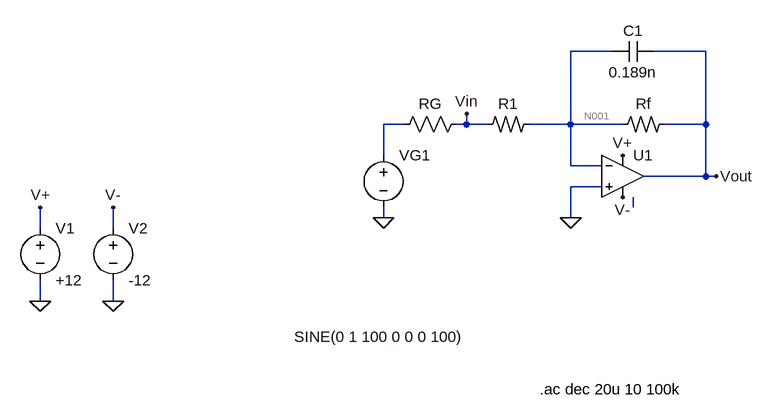
[diagram p0: schematic bode_preamp.asc]
bode_preamp.asc, the LTspice schematic file:
Version 4
SHEET 1 880 680
WIRE -368 -224 -432 -224
WIRE -224 -224 -304 -224
WIRE -688 -112 -720 -112
WIRE -592 -112 -592 -128
WIRE -592 -112 -608 -112
WIRE -560 -112 -592 -112
WIRE -432 -112 -432 -224
WIRE -432 -112 -496 -112
WIRE -352 -112 -432 -112
WIRE -224 -112 -224 -224
WIRE -224 -112 -288 -112
WIRE -720 -64 -720 -112
WIRE -432 -48 -432 -112
WIRE -384 -48 -432 -48
WIRE -224 -32 -224 -112
WIRE -224 -32 -320 -32
WIRE -208 -32 -224 -32
WIRE -384 -16 -432 -16
WIRE -336 16 -336 0
WIRE -720 32 -720 16
WIRE -432 32 -432 -16
WIRE -1248 48 -1248 16
WIRE -1136 48 -1136 16
WIRE -1248 160 -1248 128
WIRE -1136 160 -1136 128
FLAG -1248 160 0
FLAG -1136 160 0
FLAG -1248 16 V+
FLAG -1136 16 V-
FLAG -432 32 0
FLAG -208 -32 Vout
FLAG -592 -128 Vin
FLAG -352 0 V-
FLAG -352 -64 V+
FLAG -720 32 0
SYMBOL voltage -1248 32 R0
WINDOW 123 24 126 Left 2
WINDOW 39 24 111 Left 2
SYMATTR InstName V1
SYMATTR Value +12
SYMBOL voltage -1136 32 R0
WINDOW 123 24 126 Left 2
WINDOW 39 24 111 Left 2
SYMATTR InstName V2
SYMATTR Value -12
SYMBOL Opamps/UniversalOpamp2 -352 -32 R0
SYMATTR InstName U1
SYMBOL res2 -496 -128 R90
WINDOW 0 0 32 VBottom 2
WINDOW 3 43 46 Invisible 2
SYMATTR InstName R1
SYMATTR Value 82k
SYMBOL res2 -288 -128 R90
WINDOW 0 0 32 VBottom 2
WINDOW 3 32 32 Invisible 2
SYMATTR InstName Rf
SYMATTR Value 816k
SYMBOL voltage -720 -80 R0
WINDOW 3 -137 295 Left 2
WINDOW 39 0 0 Left 0
SYMATTR Value SINE(0 1 100 0 0 0 100)
SYMATTR Value2 AC 1 0
SYMATTR InstName VG1
SYMBOL res -592 -128 R90
WINDOW 0 0 56 VBottom 2
WINDOW 3 32 56 Invisible 2
SYMATTR InstName RG
SYMATTR Value 600
SYMBOL cap -304 -240 R90
WINDOW 0 0 32 VBottom 2
WINDOW 3 32 32 VTop 2
SYMATTR InstName C1
SYMATTR Value 0.189n
TEXT -480 296 Left 2 !.ac dec 20u 10 100k

The netlist it stands for:
* bode_preamp.asc
V1 V+ 0 +12
V2 V- 0 -12
XU1 0 N001 V+ V- Vout level.2 Avol=1Meg GBW=10Meg Slew=10Meg ilimit=25m rail=0 Vos=0 phimargin=45 en=0 enk=0 in=0 ink=0 Rin=500Meg  ; pins IN+ IN- V+ V- OUT
R1 N001 Vin 82k
Rf Vout N001 816k
VG1 N002 0 SINE(0 1 100 0 0 0 100) AC 1 0
RG Vin N002 600
C1 Vout N001 0.189n
.ac dec 20u 10 100k
.lib UniversalOpamps2.sub
.backanno
.end

* Results of the author's LTspice run, read from the files saved beside the schematic
* Operating Point, zero values left out:
*   V(v+) = 12 V
*   V(v-) = -12 V
*   I(V2) = 1.199 mA
*   I(V1) = -1.199 mA
*   Ix(u1:3) = 1.199 mA
*   Ix(u1:4) = -1.199 mA
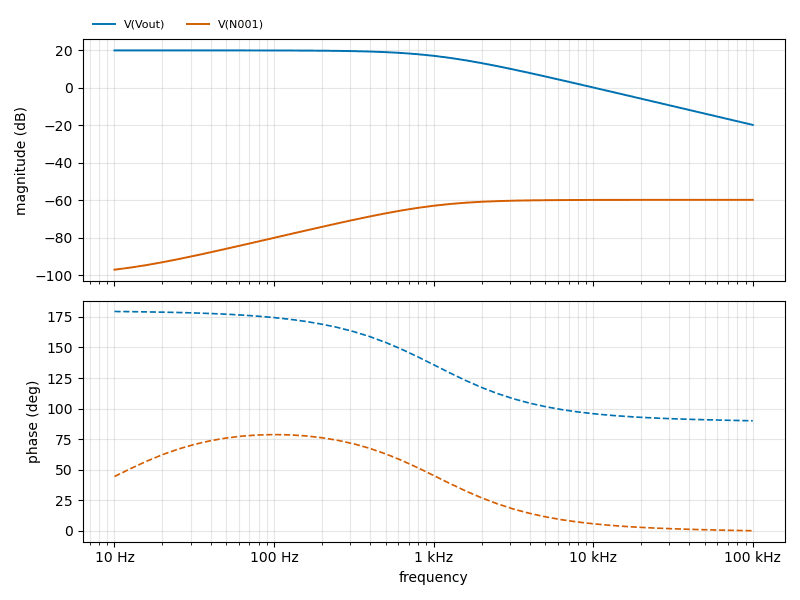
[diagram p1: AC Analysis of bode_preamp.asc, plotted from the saved traces]
* AC Analysis, 1 run:
*   V(Vout): 19.89 dB at 10 Hz, -19.84 dB at 100 kHz, peak 19.89 dB at 10 Hz, 3 dB below the peak at 1.028 kHz
*   V(N001): -97.08 dB at 10 Hz, -59.83 dB at 100 kHz, peak -59.83 dB at 100 kHz, 3 dB below the peak at 1.034 kHz